# Altium schematic sheet Connector.SchDoc
size A
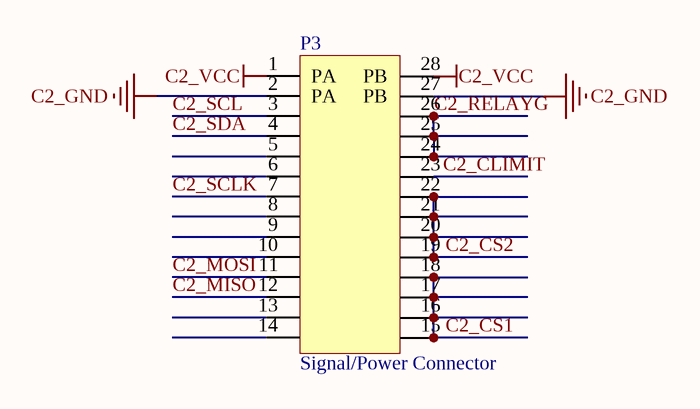
[diagram p0: Connector.SchDoc]

## Parts
P3  Signal/Power Connector  [Signal/Power Connector]

## Nets
C2_GND: P3.2(PA) P3.27(PB)
C2_VCC: P3.1(PA) P3.28(PB)
C2_CLIMIT: P3.23
C2_CS1: P3.15 P3.16 P3.17 P3.18
C2_CS2: P3.19 P3.20 P3.21 P3.22
C2_MISO: P3.12
C2_MOSI: P3.11
C2_RELAYG: P3.24 P3.25 P3.26
C2_SCL: P3.3
C2_SCLK: P3.7
C2_SDA: P3.4

Not connected (* = marked no-connect by the designer): P3 5 6 8 9 10 13 14